# Altium schematic sheet FPGA_Actel_Fusion_Eval_Board1_Rev1.SchDoc
size B; DocumentNumber: 1; SheetNumber: 1; SheetTotal: 1
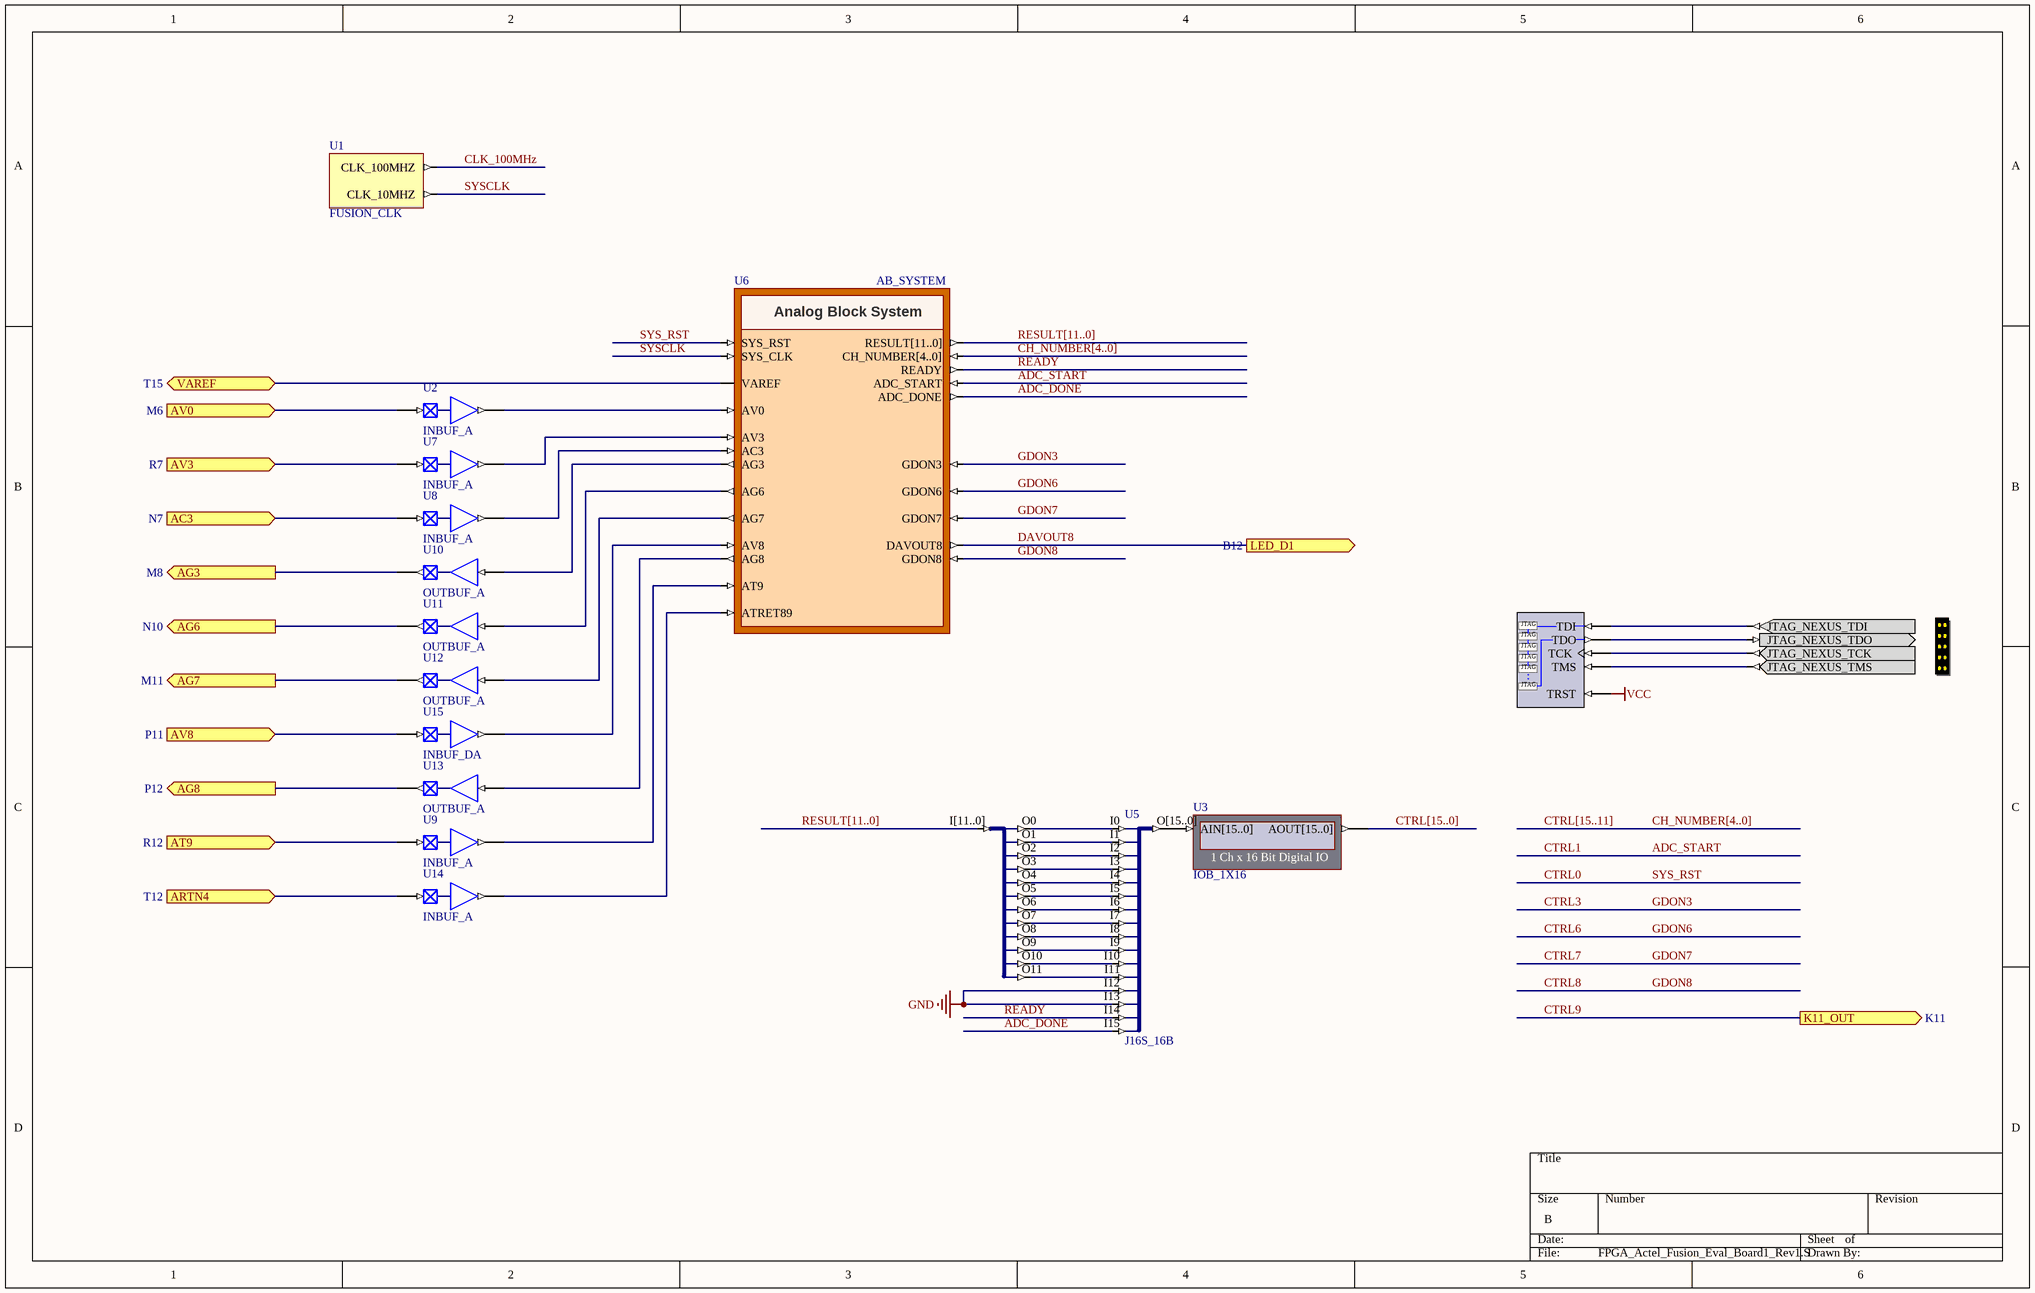
[diagram p0: FPGA_Actel_Fusion_Eval_Board1_Rev1.SchDoc]

## Parts
?  NEXUS_JTAG_CONNECTOR  (value not drawn)
NEXUS_JTAG_PORT  NEXUS_JTAG_PORT  (value not drawn)
U1  FUSION_CLK
U2  INBUF_A
U3  IOB_1X16
U4  J12B_12S  (value not drawn)
U5  J16S_16B
U6  AB_SYSTEM
U7  INBUF_A
U8  INBUF_A
U9  INBUF_A
U10  OUTBUF_A
U11  OUTBUF_A
U12  OUTBUF_A
U13  OUTBUF_A
U14  INBUF_A
U15  INBUF_DA

## Ports
AC3 (in, see N7), AG3 (out, see M8), AG6 (out, see N10), AG7 (out, see M11), AG8 (out, see P12), ARTN4 (in, see T12), AT9 (in, see R12), AV0 (in, see M6), AV3 (in, see R7), AV8 (in, see P11), K11_OUT (out, see K11), LED_D1 (out, see B12), VAREF (bidir, see T15)

## Nets
GND: U5.I12 U5.I13
VCC: NEXUS_JTAG_PORT.TRST
AC3: U8.PAD ; port AC3
ADC_DONE: U5.I15 U6.ADC_DONE
ADC_START: U6.ADC_START  [also labelled CTRL1]
AG3: U10.PAD ; port AG3
AG6: U11.PAD ; port AG6
AG7: U12.PAD ; port AG7
AG8: U13.PAD ; port AG8
ARTN4: U14.PAD ; port ARTN4
AT9: U9.PAD ; port AT9
AV0: U2.PAD ; port AV0
AV3: U7.PAD ; port AV3
AV8: U15.PAD ; port AV8
CH_NUMBER[4..0]: U6.CH_NUMBER[4..0]  [also labelled CTRL[15..11]]
CLK_100MHz: U1.CLK_100MHZ
CTRL0: U6.SYS_RST  [also labelled SYS_RST]
CTRL3: U6.GDON3  [also labelled GDON3]
CTRL6: U6.GDON6  [also labelled GDON6]
CTRL7: U6.GDON7  [also labelled GDON7]
CTRL8: U6.GDON8  [also labelled GDON8]
CTRL9: port K11_OUT
CTRL[15..0]: U3.AOUT[15..0]
DAVOUT8: U6.DAVOUT8 ; port LED_D1
READY: U5.I14 U6.READY
RESULT[11..0]: U4.I[11..0] U6.RESULT[11..0]
SYSCLK: U1.CLK_10MHZ U6.SYS_CLK
VAREF: U6.VAREF ; port VAREF
Net?_JTAG_NEXUS_TCK: ?.JTAG_NEXUS_TCK NEXUS_JTAG_PORT.TCK
Net?_JTAG_NEXUS_TDI: ?.JTAG_NEXUS_TDI NEXUS_JTAG_PORT.TDI
Net?_JTAG_NEXUS_TDO: ?.JTAG_NEXUS_TDO NEXUS_JTAG_PORT.TDO
Net?_JTAG_NEXUS_TMS: ?.JTAG_NEXUS_TMS NEXUS_JTAG_PORT.TMS
NetU2_Y: U2.Y U6.AV0
NetU3_AIN[15..0]: U3.AIN[15..0] U5.O[15..0]
NetU4_O0: U4.O0 U5.I0
NetU4_O1: U4.O1 U5.I1
NetU4_O2: U4.O2 U5.I2
NetU4_O3: U4.O3 U5.I3
NetU4_O4: U4.O4 U5.I4
NetU4_O5: U4.O5 U5.I5
NetU4_O6: U4.O6 U5.I6
NetU4_O7: U4.O7 U5.I7
NetU4_O8: U4.O8 U5.I8
NetU4_O9: U4.O9 U5.I9
NetU4_O10: U4.O10 U5.I10
NetU4_O11: U4.O11 U5.I11
NetU6_AC3: U6.AC3 U8.Y
NetU6_AG3: U6.AG3 U10.D
NetU6_AG6: U6.AG6 U11.D
NetU6_AG7: U6.AG7 U12.D
NetU6_AG8: U6.AG8 U13.D
NetU6_AT9: U6.AT9 U9.Y
NetU6_ATRET89: U6.ATRET89 U14.Y
NetU6_AV3: U6.AV3 U7.Y
NetU6_AV8: U6.AV8 U15.Y

## Buses and harness runs
bus CH_NUMBER[4..0]
bus CH_NUMBER[4..0] = CTRL[15..11]
bus CTRL[15..0]
bus RESULT[11..0]

## Notes on the sheet
- (in symbol NEXUS_JTAG_PORT) .

## Library data of the parts
? = NEXUS_JTAG_CONNECTOR: JTAG Port; PortComponent: True; Published: 19-Nov-2003; Publisher: Altium Limited; HelpURL: TR0143 NanoBoard Technical Reference Manual - NB2.pdf#page=48
NEXUS_JTAG_PORT = NEXUS_JTAG_PORT: Soft Nexus-Chain Connector; NEXUS_JTAG_CONNECTOR: True; FunctionalClass: JTAG; Published: 29-Jan-2004; Publisher: Altium Limited; LastRevisionNo: 1.00.00; HelpURL: CR0118 FPGA Generic Library Guide.pdf#page=405
U1 = FUSION_CLK: ChildModel1: GND
U2 U7-U9 U14 = INBUF_A: 2.5 Volt CMOS input levels, low power, high strength drive, low slew rate; FPGAVendor: Actel; Published: 25-Oct-2005; Publisher: Altium Limited; HelpURL: http://www.actel.com/documents/pa3_libguide.pdf
U3 = IOB_1X16: 1 Ch x 16 Bit Digital IO; NEXUS_CORE: Instrument; NEXUS_JTAG_DEVICE: True; NEXUS_JTAG_ORDER: 0; Published: 3-Nov-2004; Publisher: Altium Limited; Core Revision: 1.00.00; ComponentLink1Description: Core &Resource Usage; ComponentLink1URL: CR0134 FPGA Instrument Resource Usage.pdf#page=5; HelpURL: CR0102 IOB_x Digital IO Module.pdf; LastRevisionNo: 1.00.00
U4 = J12B_12S: 12-Bit input bus to 12 single pin outputs; FunctionalClass: Bus Joiner; PortSize: 12; ArchiveName: GENERIC; VHDLIB_SIM: GENERIC_LIB; Published: 29-Jan-2004; Publisher: Altium Limited; LastRevisionNo: 1.00.00; HelpURL: CR0118 FPGA Generic Library Guide.pdf#page=304; ComponentLink1URL: CR0126 FPGA Bus Joiner Resource Usage.pdf#page=36; ComponentLink1Description: Core &Resource Usage
U5 = J16S_16B: 16 Single pin inputs to single 16-Bit output bus; FunctionalClass: Bus Joiner; PortSize: 16; ArchiveName: GENERIC; VHDLIB_SIM: GENERIC_LIB; Published: 29-Jan-2004; Publisher: Altium Limited; LastRevisionNo: 1.00.00; HelpURL: CR0118 FPGA Generic Library Guide.pdf#page=306; ComponentLink1URL: CR0126 FPGA Bus Joiner Resource Usage.pdf#page=45; ComponentLink1Description: Core &Resource Usage
U6 = AB_SYSTEM: Analog Block System; ConfigurationParameters: {}Version[1.0]{}SystemClock[10]{}Resolution[12-Bit]{}ClockDivider[4]{}SampleTime[24]{}ExternalVref[False]{}AQ0_AV[True]{}AQ0_AC[False]{}AQ0_AT[False]{}AQ0_AG[False]{}AQ0_AV_Mode[PreScale]{}AQ0_AV_PreScaler[4 V]{}AQ0_AV_Polarity[Positive]{}AQ0_AC_Mode[PreScale]{}AQ0_AC_PreScaler[16 V]{}AQ0_AC_Polarity[Positive]{}AQ0_AT_Mode[PreScale]{}AQ0_AT_PreScaler[16 V]{}AQ0_AT_Polarity[Positive]{}AQ0_AG_Polarity[Positive]{}AQ0_AG_Current[1 uA]{}AQ1_AV[False]{}AQ1_AC[False]{}AQ1_AT[False]{}AQ1_AG[False]{}AQ1_AV_Mode[PreScale]{}AQ1_AV_PreScaler[16 V]{}AQ1_AV_Polarity[Positive]{}AQ1_AC_Mode[CurrentMonitor]{}AQ1_AC_PreScaler[16 V]{}AQ1_AC_Polarity[Positive]{}AQ1_AT_Mode[TempMonitor]{}AQ1_AT_PreScaler[16 V]{}AQ1_AT_Polarity[Positive]{}AQ1_AG_Polarity[Positive]{}AQ1_AG_Current[1 uA]{}AQ2_AV[False]{}AQ2_AC[False]{}AQ2_AT[False]{}AQ2_AG[False]{}AQ2_AV_Mode[PreScale]{}AQ2_AV_PreScaler[16 V]{}AQ2_AV_Polarity[Positive]{}AQ2_AC_Mode[PreScale]{}AQ2_AC_PreScaler[16 V]{}AQ2_AC_Polarity[Positive]{}AQ2_AT_Mode[PreScale]{}AQ2_AT_PreScaler[16 V]{}AQ2_AT_Polarity[Positive]{}AQ2_AG_Polarity[Positive]{}AQ2_AG_Current[1 uA]{}AQ3_AV[True]{}AQ3_AC[True]{}AQ3_AT[False]{}AQ3_AG[True]{}AQ3_AV_Mode[PreScale]{}AQ3_AV_PreScaler[8 V]{}AQ3_AV_Polarity[Positive]{}AQ3_AC_Mode[CurrentMonitor]{}AQ3_AC_PreScaler[16 V]{}AQ3_AC_Polarity[Positive]{}AQ3_AT_Mode[PreScale]{}AQ3_AT_PreScaler[16 V]{}AQ3_AT_Polarity[Positive]{}AQ3_AG_Polarity[Positive]{}AQ3_AG_Current[1 uA]{}AQ4_AV[False]{}AQ4_AC[False]{}AQ4_AT[False]{}AQ4_AG[False]{}AQ4_AV_Mode[PreScale]{}AQ4_AV_PreScaler[16 V]{}AQ4_AV_Polarity[Positive]{}AQ4_AC_Mode[PreScale]{}AQ4_AC_PreScaler[16 V]{}AQ4_AC_Polarity[Positive]{}AQ4_AT_Mode[PreScale]{}AQ4_AT_PreScaler[16 V]{}AQ4_AT_Polarity[Positive]{}AQ4_AG_Polarity[Positive]{}AQ4_AG_Current[1 uA]{}AQ5_AV[False]{}AQ5_AC[False]{}AQ5_AT[False]{}AQ5_AG[False]{}AQ5_AV_Mode[PreScale]{}AQ5_AV_PreScaler[16 V]{}AQ5_AV_Polarity[Positive]{}AQ5_AC_Mode[PreScale]{}AQ5_AC_PreScaler[16 V]{}AQ5_AC_Polarity[Positive]{}AQ5_AT_Mode[PreScale]{}AQ5_AT_PreScaler[16 V]{}AQ5_AT_Polarity[Positive]{}AQ5_AG_Polarity[Positive]{}AQ5_AG_Current[1 uA]{}AQ6_AV[False]{}AQ6_AC[False]{}AQ6_AT[False]{}AQ6_AG[True]{}AQ6_AV_Mode[PreScale]{}AQ6_AV_PreScaler[16 V]{}AQ6_AV_Polarity[Positive]{}AQ6_AC_Mode[PreScale]{}AQ6_AC_PreScaler[16 V]{}AQ6_AC_Polarity[Positive]{}AQ6_AT_Mode[PreScale]{}AQ6_AT_PreScaler[16 V]{}AQ6_AT_Polarity[Positive]{}AQ6_AG_Polarity[Negative]{}AQ6_AG_Current[25 mA]{}AQ7_AV[False]{}AQ7_AC[False]{}AQ7_AT[False]{}AQ7_AG[True]{}AQ7_AV_Mode[PreScale]{}AQ7_AV_PreScaler[16 V]{}AQ7_AV_Polarity[Positive]{}AQ7_AC_Mode[PreScale]{}AQ7_AC_PreScaler[16 V]{}AQ7_AC_Polarity[Positive]{}AQ7_AT_Mode[PreScale]{}AQ7_AT_PreScaler[16 V]{}AQ7_AT_Polarity[Positive]{}AQ7_AG_Polarity[Negative]{}AQ7_AG_Current[25 mA]{}AQ8_AV[True]{}AQ8_AC[False]{}AQ8_AT[False]{}AQ8_AG[True]{}AQ8_AV_Mode[DigitalInput]{}AQ8_AV_PreScaler[16 V]{}AQ8_AV_Polarity[Positive]{}AQ8_AC_Mode[DigitalInput]{}AQ8_AC_PreScaler[16 V]{}AQ8_AC_Polarity[Positive]{}AQ8_AT_Mode[PreScale]{}AQ8_AT_PreScaler[16 V]{}AQ8_AT_Polarity[Positive]{}AQ8_AG_Polarity[Negative]{}AQ8_AG_Current[25 mA]{}AQ9_AV[False]{}AQ9_AC[False]{}AQ9_AT[True]{}AQ9_AG[False]{}AQ9_AV_Mode[PreScale]{}AQ9_AV_PreScaler[16 V]{}AQ9_AV_Polarity[Positive]{}AQ9_AC_Mode[PreScale]{}AQ9_AC_PreScaler[16 V]{}AQ9_AC_Polarity[Positive]{}AQ9_AT_Mode[TempMonitor]{}AQ9_AT_PreScaler[16 V]{}AQ9_AT_Polarity[Positive]{}AQ9_AG_Polarity[Positive]{}AQ9_AG_Current[1 uA]{}; ConfiguratorName: AB_SYSTEM; ComponentLink1Description: Core &Resource Usage; ComponentLink1URL: CR0139 FPGA Peripheral Resource Usage.pdf#page=46; HelpURL: CR0167 WB_VGA Configurable Wishbone Display Driver.pdf; LastRevisionNo: 1.00.00; Published: 27-Mar-2005; Publisher: Altium Limited
U10-U13 = OUTBUF_A: 2.5 Volt CMOS input levels, low power, normal slew; FPGAVendor: Actel; Published: 25-Oct-2005; Publisher: Altium Limited; HelpURL: http://www.actel.com/documents/pa3_libguide.pdf
U15 = INBUF_DA: 2.5 Volt CMOS input levels, low power, high strength drive, low slew rate; FPGAVendor: Actel; Published: 25-Oct-2005; Publisher: Altium Limited; HelpURL: http://www.actel.com/documents/pa3_libguide.pdf